# Altium project PR2017-DC_LoadMotherBoard.PrjPcb
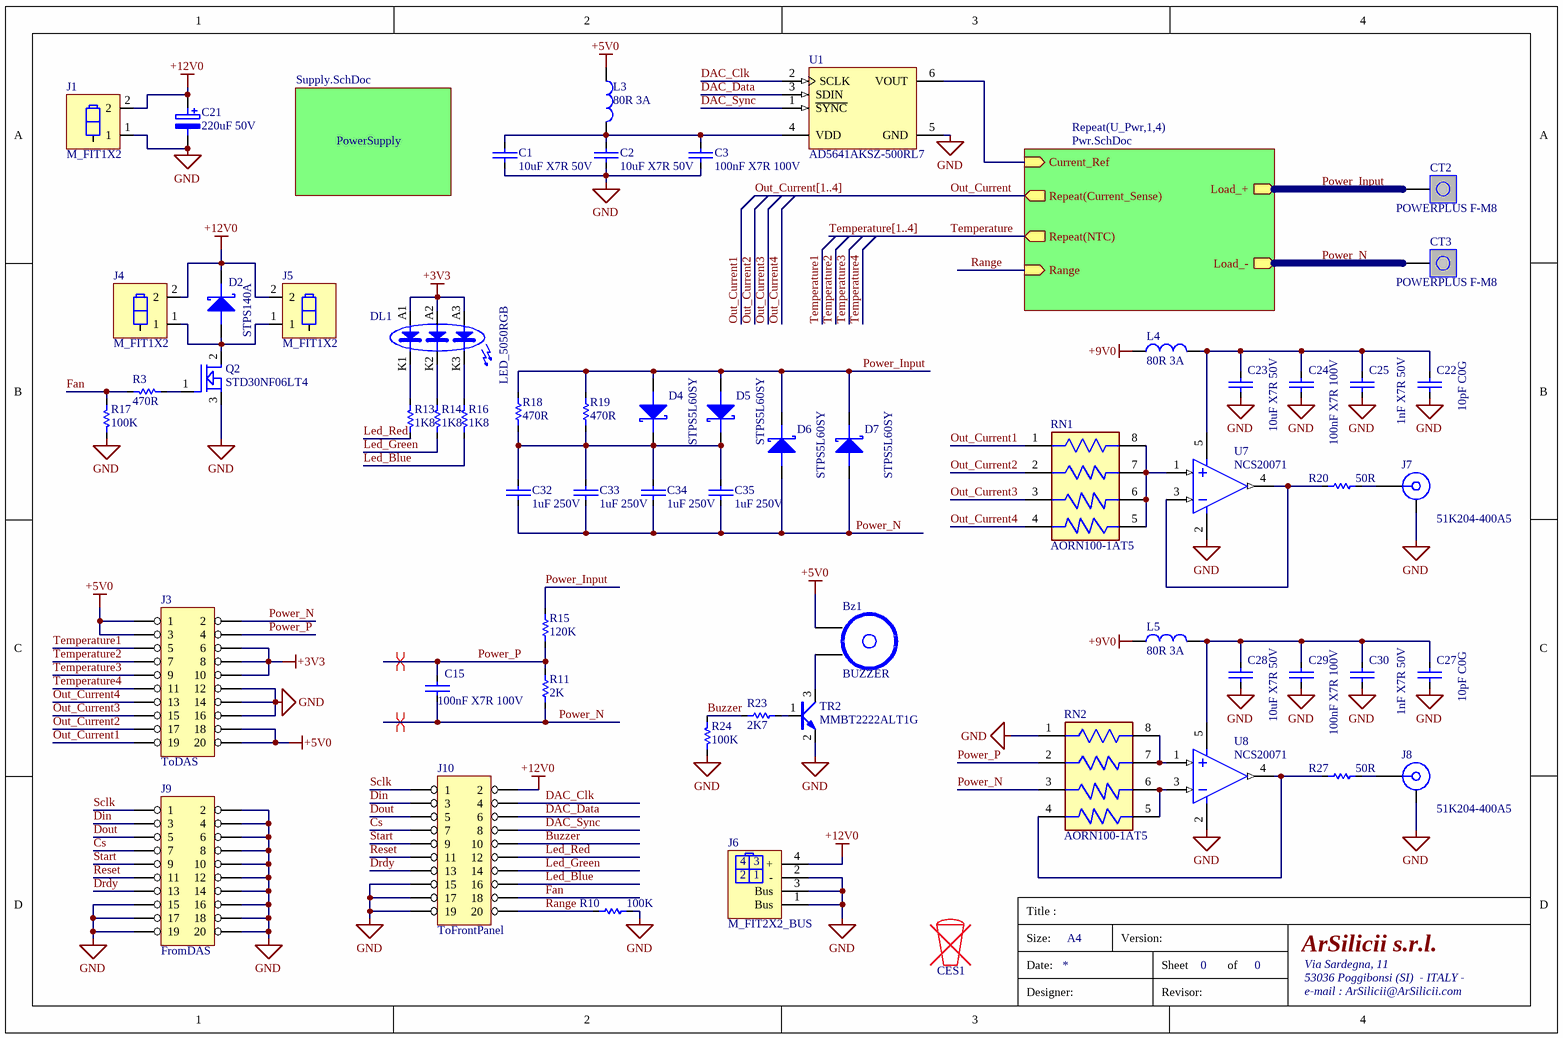
[diagram p0: PR2017-DC_LoadMotherBoard.SchDoc]
3 sheets, 193 parts. Net scope: hierarchical (ports join the sheet entries above them; power ports are global).
Board file: PR2017-DC_Load_Mosfet.PcbDoc
Sheets:
  PR2017-DC_LoadMotherBoard.SchDoc
    U_Pwr1 = Pwr.SchDoc
    U_Pwr2 = Pwr.SchDoc
    U_Pwr3 = Pwr.SchDoc
    U_Pwr4 = Pwr.SchDoc
    PowerSupply = Supply.SchDoc

## Sheet PR2017-DC_LoadMotherBoard.SchDoc
size A4; Organization: ArSilicii s.r.l.; Address1: Via Sardegna, 11; Address2: 53036 Poggibonsi (SI)  - ITALY -; Address3: e-mail : ArSilicii@ArSilicii.com; SheetNumber: 0; SheetTotal: 0

### Parts
Bz1  BUZZER  [CB13PA]
C1  10uF X7R 50V  [1206]
C2  10uF X7R 50V  [1206]
C3  100nF X7R 100V  [0805]
C15  100nF X7R 100V  [0805]
C21  220uF 50V  [C_G55]
C22  10pF C0G  [0805]
C23  10uF X7R 50V  [1206]
C24  100nF X7R 100V  [0805]
C25  1nF X7R 50V  [0603]
C27  10pF C0G  [0805]
C28  10uF X7R 50V  [1206]
C29  100nF X7R 100V  [0805]
C30  1nF X7R 50V  [0603]
C32  1uF 250V  [POL-P15]
C33  1uF 250V  [POL-P15]
C34  1uF 250V  [POL-P15]
C35  1uF 250V  [POL-P15]
CES1  CESTINO  [Cestino1]  (value not drawn)
CT2  POWERPLUS F-M8  [PowerPlus M8]
CT3  POWERPLUS F-M8  [PowerPlus M8]
D2  STPS140A  [SMA]
D4  STPS5L60SY  [SMC]
D5  STPS5L60SY  [SMC]
D6  STPS5L60SY  [SMC]
D7  STPS5L60SY  [SMC]
DL1  LED_5050RGB  [LED_5050RGB]
J1  M_FIT1X2  [M_FIT_JR1X2V]
J3  ToDAS  [IDC-20]
J4  M_FIT1X2  [M_FIT_JR1X2V]
J5  M_FIT1X2  [M_FIT_JR1X2V]
J6  M_FIT2X2_BUS  [M_FIT_JR2X2V]
J7  51K204-400A5  [ROS-51K204-400A5_V]
J8  51K204-400A5  [ROS-51K204-400A5_V]
J9  FromDAS  [IDC-20]
J10  ToFrontPanel  [IDC-20]
L3  80R 3A  [1206]
L4  80R 3A  [1206]
L5  80R 3A  [1206]
Q2  STD30NF06LT4  [DPAK]
R3  470R  [0805]
R10  100K  [0805]
R11  2K  [2512]
R13  1K8  [0805]
R14  1K8  [0805]
R15  120K  [2512]
R16  1K8  [0805]
R17  100K  [0805]
R18  470R  [0805]
R19  470R  [0805]
R20  50R  [0805]
R23  2K7  [0805]
R24  100K  [0805]
R27  50R  [0805]
RN1  AORN100-1AT5  [FP-AORN100-1AT5-IPC_C]
RN2  AORN100-1AT5  [FP-AORN100-1AT5-IPC_C]
TR2  MMBT2222ALT1G  [SOT-23]
U1  AD5641AKSZ-500RL7  [KS-6_L]
U7  NCS20071  [SOT-553-5]
U8  NCS20071  [SOT-553-5]

### Sub-sheets
PowerSupply = Supply.SchDoc: no entries
Repeat(U_Pwr,1,4) = Pwr.SchDoc: Current_Ref (in), Load_+ (out), Load_- (out), Repeat(Current_Sense) (out), Repeat(NTC) (out), Range (in)

### Nets
+3V3: DL1.A1 DL1.A2 DL1.A3 J3.6 J3.8 J3.10
+5V0: Bz1.1 J3.1 J3.3 J3.18 J3.20 L3.1
+9V0: L4.1 L5.1
+12V0: C21.1 D2.K J1.2 J4.2 J5.2 J6.4(+) J10.2
GND: C1.2 C2.2 C3.2 C21.2 C22.2 C23.2 C24.2 C25.2 C27.2 C28.2 C29.2 C30.2 J1.1 J3.12 J3.14 J3.16 J6.1(Bus) J6.2(-) J6.3(Bus) J7.MH J8.MH J9.2 J9.4 J9.6 J9.8 J9.10 J9.12 J9.14 J9.15 J9.16 J9.17 J9.18 J9.19 J9.20 J10.15 J10.17 J10.19 Q2.3(SOURCE) R10.1 R17.1 R24.1 RN2.1 TR2.2(E) U1.5(GND) U7.2 U8.2
Buzzer: J10.10 R23.2 R24.2
Cs: J9.7 J10.7
DAC_Clk: J10.4 U1.2(SCLK)
DAC_Data: J10.6 U1.3(SDIN)
DAC_Sync: J10.8 U1.1(~{SYNC})
Din: J9.3 J10.3
Dout: J9.5 J10.5
Drdy: J9.13 J10.13
Fan: J10.18 R3.2 R17.2
Led_Blue: J10.16 R16.1
Led_Green: J10.14 R14.1
Led_Red: J10.12 R13.1
Out_Current: sheet Repeat(U_Pwr,1,4)/Repeat(Current_Sense)
Out_Current1: J3.19 RN1.1
Out_Current2: J3.17 RN1.2
Out_Current3: J3.15 RN1.3
Out_Current4: J3.13 RN1.4
Power_Input: CT2.1 D4.A D5.A D6.K D7.K R15.1 R18.1 R19.1 ; sheet Repeat(U_Pwr,1,4)/Load_+
Power_N: C15.2 C32.2 C33.2 C34.2 C35.2 CT3.1 D6.A D7.A J3.2 R11.2 RN2.3 ; sheet Repeat(U_Pwr,1,4)/Load_-
Power_P: C15.1 J3.4 R11.1 R15.2 RN2.2
Range: J10.20 R10.2 ; sheet Repeat(U_Pwr,1,4)/Range
Reset: J9.11 J10.11
Sclk: J9.1 J10.1
Start: J9.9 J10.9
Temperature: sheet Repeat(U_Pwr,1,4)/Repeat(NTC)
Temperature1: J3.5
Temperature2: J3.7
Temperature3: J3.9
Temperature4: J3.11
NetBz1_2: Bz1.2 TR2.3(C)
NetC1_1: C1.1 C2.1 C3.1 L3.2 U1.4(VDD)
NetC22_1: C22.1 C23.1 C24.1 C25.1 L4.2 U7.5
NetC27_1: C27.1 C28.1 C29.1 C30.1 L5.2 U8.5
NetC32_1: C32.1 C33.1 C34.1 C35.1 D4.K D5.K R18.2 R19.2
NetD2_A: D2.A J4.1 J5.1 Q2.2(DRAIN)
NetDL1_K1: DL1.K1 R13.2
NetDL1_K2: DL1.K2 R14.2
NetDL1_K3: DL1.K3 R16.2
NetJ7_1: J7.1 R20.1
NetJ8_1: J8.1 R27.1
NetQ2_1: Q2.1(GATE) R3.1
NetR20_2: R20.2 U7.3 U7.4
NetR21_U_Pwr1_1: U1.6(VOUT) ; sheet Repeat(U_Pwr,1,4)/Current_Ref
NetR23_1: R23.1 TR2.1(B)
NetR27_2: R27.2 RN2.4 U8.4
NetRN1_5: RN1.5 RN1.6 RN1.7 RN1.8 U7.1
NetRN2_5: RN2.5 RN2.6 U8.3
NetRN2_7: RN2.7 RN2.8 U8.1

### Buses and harness runs
bus Out_Current[1..4]
bus Temperature[1..4]

### Layout directives
differential pair: Power_N, Power_P

### Notes on the sheet
- Title :
- Size:
- Date:
- A4
- Version:
- Sheet
- of
- Designer:
- Revisor:

### Library data of the parts
Bz1 = BUZZER: SMD/TH: TH; 1 Supplier: *; 1 Supplier Part Number: *; 1 Supplier Unit Price: *; 2 Supplier: *; 2 Supplier Part Number: *; 2 Supplier Unit Price: *; 3 Supplier: *; 3 Supplier Part Number: *; 3 Supplier Unit Price: *; ArSilicii Part Number: *; Manufacturer: *; Manufacturer Part Number: *; ComponentLink1URL: *; ComponentLink2URL: *; ComponentLink1Description: *; ComponentLink2Description: *; HelpURL: *
C1 C2 C23 C28 = CAP_10uF X7R 50V_1206: Capacità; ArSilicii Part Number: CPC0232011; Manufacturer Part Number: CL31B106KBHNNNE; SMD/TH: SMD; 1 Supplier: ARROW ELECTRONICS ITALIA S.R.L.; 1 Supplier Part Number: CL31B106KBHNNNE; 1 Supplier Unit Price: *; 2 Supplier: *; 2 Supplier Part Number: *; 2 Supplier Unit Price: *; 3 Supplier: *; 3 Supplier Part Number: *; 3 Supplier Unit Price: *; Manufacturer: *; ComponentLink1URL: *; ComponentLink2URL: *; ComponentLink1Description: Datasheet for 10uF X7R 25V; ComponentLink2Description: *; HelpURL: *
C3 C15 C24 C29 = CAP_100nF X7R 100V_0805: Capacità; ArSilicii Part Number: CPC0213101; Manufacturer: SAMSUNG; Manufacturer Part Number: CL21B104KCFSFNG; SMD/TH: SMD; 1 Supplier: ARROW ELECTRONICS ITALIA S.R.L.; 1 Supplier Part Number: CL21B104KCFSFNG; 1 Supplier Unit Price: *; 2 Supplier: FARNELL ITALIA S.R.L.; 2 Supplier Part Number: 1907331; 2 Supplier Unit Price: *; 3 Supplier: *; 3 Supplier Part Number: *; 3 Supplier Unit Price: *; ComponentLink1URL: *; ComponentLink2URL: *; ComponentLink1Description: *; ComponentLink2Description: *; HelpURL: *
C21 = CAP_EL_220uF 50V: Capacità polarizzata; ArSilicii Part Number: CPC0402221; Manufacturer: Nichicon; Manufacturer Part Number: UPS1H221MPD; SMD/TH: TH; 1 Supplier: ARROW ELECTRONICS ITALIA S.R.L.; 1 Supplier Part Number: *; 1 Supplier Unit Price: 0,04516; 2 Supplier: RS COMPONENTS S.P.A.; 2 Supplier Part Number: 5194346; 2 Supplier Unit Price: *; 3 Supplier: *; 3 Supplier Part Number: *; 3 Supplier Unit Price: *; ComponentLink1URL: http://docs-europe.electrocomponents.com/webdocs/0649/0900766b8064973a.pdf; ComponentLink2URL: *; ComponentLink1Description: Datasheet for 220uF 50V; ComponentLink2Description: *; HelpURL: *
C22 C27 = CAP_10pF C0G_0805: Capacità; ArSilicii Part Number: CPC0614010; SMD/TH: SMD; 1 Supplier: *; 1 Supplier Part Number: *; 1 Supplier Unit Price: 0,09; 2 Supplier: *; 2 Supplier Part Number: *; 2 Supplier Unit Price: *; 3 Supplier: *; 3 Supplier Part Number: *; 3 Supplier Unit Price: *; Manufacturer: *; Manufacturer Part Number: *; ComponentLink1URL: *; ComponentLink2URL: *; ComponentLink1Description: *; ComponentLink2Description: *; HelpURL: *
C25 C30 = CAP_1nF X7R 50V_0603: Capacità; ArSilicii Part Number: CPC0263001; Manufacturer: KEMET; Manufacturer Part Number: C0603C102K5RACTU; SMD/TH: SMD; 1 Supplier: ARROW ELECTRONICS ITALIA S.R.L.; 1 Supplier Part Number: CC0603JRX7R9BB102; 1 Supplier Unit Price: *; 2 Supplier: *; 2 Supplier Part Number: *; 2 Supplier Unit Price: *; 3 Supplier: *; 3 Supplier Part Number: *; 3 Supplier Unit Price: *; ComponentLink1URL: *; ComponentLink2URL: *; ComponentLink1Description: *; ComponentLink2Description: *; HelpURL: *
C32-C35 = CAP_POL_1uF 250V P.15: Capacità poliestere; ArSilicii Part Number: CPC0502002; Manufacturer Part Number: MKTR60II4100ZB30K; SMD/TH: TH; 1 Supplier: *; 1 Supplier Part Number: *; 1 Supplier Unit Price: *; 2 Supplier: *; 2 Supplier Part Number: *; 2 Supplier Unit Price: *; 3 Supplier: *; 3 Supplier Part Number: *; 3 Supplier Unit Price: *; Manufacturer: *; ComponentLink1URL: *; ComponentLink2URL: *; ComponentLink1Description: *; ComponentLink2Description: *; HelpURL: *
CT2 CT3 = PAD_POWERPLUS F-M8: Singolo contatto; ArSilicii Part Number: QC04000180; Manufacturer: WURTH; Manufacturer Part Number: 93517; SMD/TH: TH; 1 Supplier: Würth Elektronik ICS GmbH & Co. KG; 1 Supplier Part Number: S98978; 1 Supplier Unit Price: *; 2 Supplier: *; 2 Supplier Part Number: *; 2 Supplier Unit Price: *; 3 Supplier: *; 3 Supplier Part Number: *; 3 Supplier Unit Price: *; ComponentLink1URL: *; ComponentLink2URL: *; ComponentLink1Description: *; ComponentLink2Description: *; HelpURL: *
D2 = DIODE SCHOTTKY_STPS140A: Diodo Schottky; Manufacturer: STMicroelectronics; ArSilicii Part Number: CPDS117000; SMD/TH: SMD; Manufacturer Part Number: STPS140A; 1 Supplier Part Number: STMSTPS140A; 2 Supplier: *; 2 Supplier Part Number: *; 2 Supplier Unit Price: *; 3 Supplier Part Number: *; 1 Supplier: ARROW ELECTRONICS ITALIA S.R.L.; 1 Supplier Unit Price: 0,0600; 3 Supplier: *; 3 Supplier Unit Price: *; ComponentLink1URL: http://www.st.com/web/en/resource/technical/document/datasheet/CD00001107.pdf; ComponentLink2URL: *; ComponentLink1Description: Datasheet for STPS140A; ComponentLink2Description: *; HelpURL: *
D4-D7 = DIODE SCHOTTKY_STPS5L60SY: Automotive power Schottky rectifier; Manufacturer: STM; SMD/TH: SMD; Manufacturer Part Number: STPS5L60SY; 1 Supplier Part Number: 511-STPS5L60SY; 2 Supplier: *; 2 Supplier Part Number: *; 2 Supplier Unit Price: *; 3 Supplier Part Number: *; 1 Supplier: MOUSER; 1 Supplier Unit Price: 0,678; 3 Supplier: *; 3 Supplier Unit Price: *; ArSilicii Part Number: *; ComponentLink2URL: *; ComponentLink2Description: *; HelpURL: *
DL1 = LED_5050RGB: LED RGB; SMD/TH: SMD; 1 Supplier: *; 1 Supplier Part Number: *; 1 Supplier Unit Price: *; 2 Supplier: *; 2 Supplier Part Number: *; 2 Supplier Unit Price: *; 3 Supplier: *; 3 Supplier Part Number: *; 3 Supplier Unit Price: *; ArSilicii Part Number: *; Manufacturer: *; Manufacturer Part Number: *; ComponentLink1URL: *; ComponentLink2URL: *; ComponentLink1Description: *; ComponentLink2Description: *; HelpURL: *
J1 J4 J5 = M_FIT1X2: Mini Fit Junior 2 poli; ArSilicii Part Number: QA02006000; Manufacturer: Molex; SMD/TH: TH; 1 Supplier: ABACUS ECC S.R.L. - UNIPERSONALE; 1 Supplier Part Number: *; 1 Supplier Unit Price: 0,07900; 2 Supplier: HT COMPONENTI ELETTRONICI S.R.L.; 2 Supplier Part Number: *; 2 Supplier Unit Price: *; 3 Supplier: *; 3 Supplier Part Number: *; 3 Supplier Unit Price: *; Manufacturer Part Number: 39-28-1023; ComponentLink1URL: http://www.molex.com/webdocs/datasheets/pdf/en-us/0039281023_PCB_HEADERS.pdf; ComponentLink2URL: *; ComponentLink1Description: Datasheet for M_FIT1X2; ComponentLink2Description: *; HelpURL: *
J3 J9 = HEADER 10X2: System: Connector; SMD/TH: TH; 1 Supplier: *; 1 Supplier Part Number: *; 1 Supplier Unit Price: *; 2 Supplier: *; 2 Supplier Part Number: *; 2 Supplier Unit Price: *; 3 Supplier: *; 3 Supplier Part Number: *; 3 Supplier Unit Price: *; ArSilicii Part Number: *; Manufacturer: *; Manufacturer Part Number: *; ComponentLink2URL: *; ComponentLink2Description: *
  J3: Parameter 1: *; Parameter 2: *; ComponentLink4Description: *; ComponentLink4URL: *
  J9: ComponentLink1URL: *; ComponentLink1Description: *
J6 = M_FIT2X2_BUS: Mini Fit Junior 4 poli; ArSilicii Part Number: QA02009000; Manufacturer: Molex; SMD/TH: TH; 1 Supplier: ABACUS ECC S.R.L. - UNIPERSONALE; 1 Supplier Part Number: *; 1 Supplier Unit Price: 0,08856; 2 Supplier: SIRIO S.R.L.; 2 Supplier Part Number: P6657I-04; 2 Supplier Unit Price: *; 3 Supplier: ELECTRONIC CENTER S.P.A.; 3 Supplier Part Number: EY5900-W04ST; 3 Supplier Unit Price: *; Manufacturer Part Number: 39-28-1043; ComponentLink1URL: http://www.molex.com/webdocs/datasheets/pdf/en-us/0039281043_PCB_HEADERS.pdf; ComponentLink2URL: *; ComponentLink1Description: Datasheet for M_FIT2X2; ComponentLink2Description: *; HelpURL: *
J7 J8 = CMP-0753-00004-1: BNC 50R Right Angle Jack, Panel Feedthrough, Up to 10 GHz, -55 to 155 degC; Manufacturer: Rosenberger; Design Note: Footprint in library is a generic example - only application specific footprint delivers High Performance; PartNumber: 51K204-400A5; PackageReference: 51K204-400A5; DatasheetVersion: d00; ComponentLink2Description: Datasheet; ComponentLink5Description: Webshop / RFQ; ComponentLink1URL: http://www.rosenberger.de; ComponentLink4URL: http://rosenberger.de/ok/images/documents/spez/51.pdf; PackageVersion: d00; ComponentLink5URL: http://www.rosenberger.com/en/contact/sales/; ComponentLink3URL: http://rosenberger.de/ok/images/documents/db/51K204-400A5.pdf; ComponentLink2URL: http://rosenberger.de/ok/images/documents/db/51K204-400A5.pdf; ComponentLink1Description: Manufacturer URL; Mounting Technology: Through Hole; PackageDescription: 50R BNC Right Angle Jack, 12.5 x 32.6 x 14.5 mm; ComponentLink4Description: Series Overview / Design Note; ComponentLink3Description: Package Specification
J10 = HEADER 10X2: SMD/TH: TH; 1 Supplier: *; 1 Supplier Part Number: *; 1 Supplier Unit Price: *; 2 Supplier: *; 2 Supplier Part Number: *; 2 Supplier Unit Price: *; 3 Supplier: *; 3 Supplier Part Number: *; 3 Supplier Unit Price: *; ArSilicii Part Number: *; Manufacturer: *; Manufacturer Part Number: *; ComponentLink2URL: *; ComponentLink2Description: *; Parameter 1: *; Parameter 2: *; ComponentLink4Description: *; ComponentLink4URL: *
L3-L5 = Ferrite 80R 3A: Ferrite; ArSilicii Part Number: CPF0006000; Manufacturer: Wurth Elektronik; Manufacturer Part Number: 74279215; SMD/TH: SMD; 1 Supplier: RS COMPONENTS S.P.A.; 1 Supplier Part Number: 3275550P; 1 Supplier Unit Price: 0,21000; 2 Supplier: *; 2 Supplier Part Number: *; 2 Supplier Unit Price: *; 3 Supplier: *; 3 Supplier Part Number: *; 3 Supplier Unit Price: *; ComponentLink1URL: http://docs-europe.electrocomponents.com/webdocs/0033/0900766b80033a26.pdf; ComponentLink2URL: *; ComponentLink1Description: Datasheet for Ferrite 80R 3A; ComponentLink2Description: *; HelpURL: *; Supplier 1: Digi-Key; Supplier Part Number 1: 732-1629-1-ND
Q2 = MOS-N STD30NF06: N-CHANNEL 60V - 0.020 Ω - 28A IPAK/DPAK  STripFET™ II POWER MOSFET; ArSilicii Part Number: CPTP200030; Manufacturer: STMicroelectronics; SMD/TH: SMD; 1 Supplier: EBV ELEKTRONIK S.R.L.; 1 Supplier Part Number: STD30NF06LT4/STM; 1 Supplier Unit Price: 0,203; 2 Supplier: *; 2 Supplier Part Number: *; 2 Supplier Unit Price: *; 3 Supplier: *; 3 Supplier Part Number: *; 3 Supplier Unit Price: *; Manufacturer Part Number: STD30NF06LT4; ComponentLink1URL: http://www.mouser.com/ds/2/389/CD00002155-250311.pdf; ComponentLink2URL: *; ComponentLink1Description: Datasheet for STD30NF06LT4; ComponentLink2Description: *; HelpURL: *; Supplier 1: Digi-Key; Supplier Part Number 1: 497-4101-1-ND
R3 R10 R11 R13-R20 R23 R24 R27 = RES_SMD: Resistenza; SMD/TH: SMD; 1 Supplier: *; 1 Supplier Part Number: *; 1 Supplier Unit Price: *; 2 Supplier: *; 2 Supplier Part Number: *; 2 Supplier Unit Price: *; 3 Supplier: *; 3 Supplier Part Number: *; 3 Supplier Unit Price: *; ArSilicii Part Number: *; Manufacturer: *; Manufacturer Part Number: *; ComponentLink1URL: *; ComponentLink2URL: *; ComponentLink1Description: *; ComponentLink2Description: *; HelpURL: *
RN1 RN2 = CMP-02406-000003-1: RES NETWORK 4 RES MULT OHM 8SOIC; Manufacturer: Vishay; Resistance: 1/100kΩ; Standoff Height: 0.1524mm; Temperature Coefficient: 25ppm/°C; Automotive Grade: Grade 0; Tolerance: 0.1%; Number Of Resistors: 4; Value: 1/100kΩ; Power Per Resistor: 100mW; Power Rating: 400mW; Lead Free: Yes; Package: AORN100-1AT5; Manufacturer Part Number: AORN100-1AT5; Category: Res; Temperature Range High: +155°C; Device Class L3: Resistor Arrays; Automotive: Yes; Temperature: -55°C to +155°C; Termination: Gull-Wing; Ipc Land Pattern Name: SOIC127P607X173-8; Device Class L1: Passive Components; Series: AORN; Octopart: https://octopart.com/aorn1001at5-vishay-54384707; ComponentLink2Description: Datasheet; Digikey Description: RES NETWORK 4 RES MULT OHM 8SOIC; Composition: Thin Film; Device Class L2: Resistors; ComponentLink2URL: https://www.vishay.com/docs/60127/aorn.pdf; RoHS: TRUE; Temperature Range Low: -55°C; Height: 1.73mm
TR2 = NPN_MMBT2222ALT1G: NPN Transistor; ArSilicii Part Number: CPTS001000; Manufacturer: ON SEMICONDUCTOR; SMD/TH: SMD; Supplier 1: Farnell; Supplier Part Number 1: 1459098; 1 Supplier: ARROW ELECTRONICS ITALIA S.R.L.; 1 Supplier Part Number: SCGMMBT2222ALT1G; 1 Supplier Unit Price: 0,00777; 2 Supplier: Farnell; 2 Supplier Part Number: 1459098; 2 Supplier Unit Price: 0,085; 3 Supplier: *; 3 Supplier Part Number: *; 3 Supplier Unit Price: *; Manufacturer Part Number: MMBT2222ALT1G; ComponentLink1URL: http://www.onsemi.com/pub_link/Collateral/MMBT2222LT1-D.PDF; ComponentLink2URL: *; ComponentLink1Description: Datasheet for MMBT2222ALT1G; ComponentLink2Description: *; HelpURL: D:\Documenti ArSilicii\DataSheet\Transistor\MMBT2222LT1-D.pdf
U1 = CMP-0318-01433-2: Single 14-Bit nanoDAC with SPI Interface, 5 V, <100 uA, -40 to +125 degC, KS-6, Pb-Free, Reel; Generic Part Number: AD5641; Manufacturer: Analog Devices; Resolution (Bits): 14; Max V+: 5.5V; Settling Time: 6Âµs; # DAC Outputs: 1; Single Supply: Yes; Op Pwr Diss: 550ÂµW; ComponentLink1URL: http://www.analog.com/en/index.html; ComponentLink3Description: Package Specification; ComponentLink4URL: http://www.analog.com/en/digital-to-analog-converters/da-converters/ad5641/products/product.html; RevisionNote: Component URL fixed; PackageReference: KS-6; Packing: Reel; ComponentLink3URL: http://www.analog.com/static/imported-files/packages/PKG_PDF/SC70(KS)/KS_6.pdf; PackageVersion: 072809-A; RoHS: Y; ComponentLink2Description: Datasheet; PartNumber: AD5641AKSZ-500RL7; Mounting Technology: Surface Mount; ComponentLink2URL: http://www.analog.com/static/imported-files/data_sheets/AD5641.pdf; ComponentLink4Description: Product URL; PackageDescription: 6-Lead Thin Shrink Small Outline Transistor Package [SC70]; ComponentLink1Description: Manufacturer URL; DatasheetVersion: Rev.D; Code_JEDEC: MO-203-AB
U7 U8 = NCS20071: Rail-to-Rail Input/Output, 3 MHz Op Amps; Manufacturer: Microchip Technology; Manufacturer Part Number: MCP6021-E/SN; SMD/TH: SMD; 1 Supplier: DigiKey; 1 Supplier Part Number: MCP6021-E/SN-ND; 1 Supplier Unit Price: 1,22; 2 Supplier: *; 2 Supplier Part Number: *; 2 Supplier Unit Price: *; 3 Supplier: *; 3 Supplier Part Number: *; 3 Supplier Unit Price: *; ArSilicii Part Number: *; ComponentLink1URL: http://ww1.microchip.com/downloads/en/DeviceDoc/21685d.pdf; ComponentLink2URL: *; ComponentLink1Description: Datasheet for MCP6021; ComponentLink2Description: *; HelpURL: *
CES1 = CESTINO: 1 Supplier: *; 1 Supplier Part Number: *; 1 Supplier Unit Price: *; 2 Supplier: *; 2 Supplier Part Number: *; 2 Supplier Unit Price: *; 3 Supplier: *; 3 Supplier Part Number: *; 3 Supplier Unit Price: *; ArSilicii Part Number: *; Manufacturer: *; Manufacturer Part Number: *; ComponentLink1URL: *; ComponentLink2URL: *; ComponentLink1Description: *; ComponentLink2Description: *; HelpURL: *; SMD/TH: *

## Sheet Pwr.SchDoc
size A4; Organization: ArSilicii s.r.l.; Address1: Via Sardegna, 11; Address2: 53036 Poggibonsi (SI)  - ITALY -; Address3: e-mail : ArSilicii@ArSilicii.com; SheetNumber: 0; SheetTotal: 0
Used 4 times, as channels U_Pwr1, U_Pwr2, U_Pwr3, U_Pwr4. Parts and nets are listed once, with the designators drawn on the sheet.
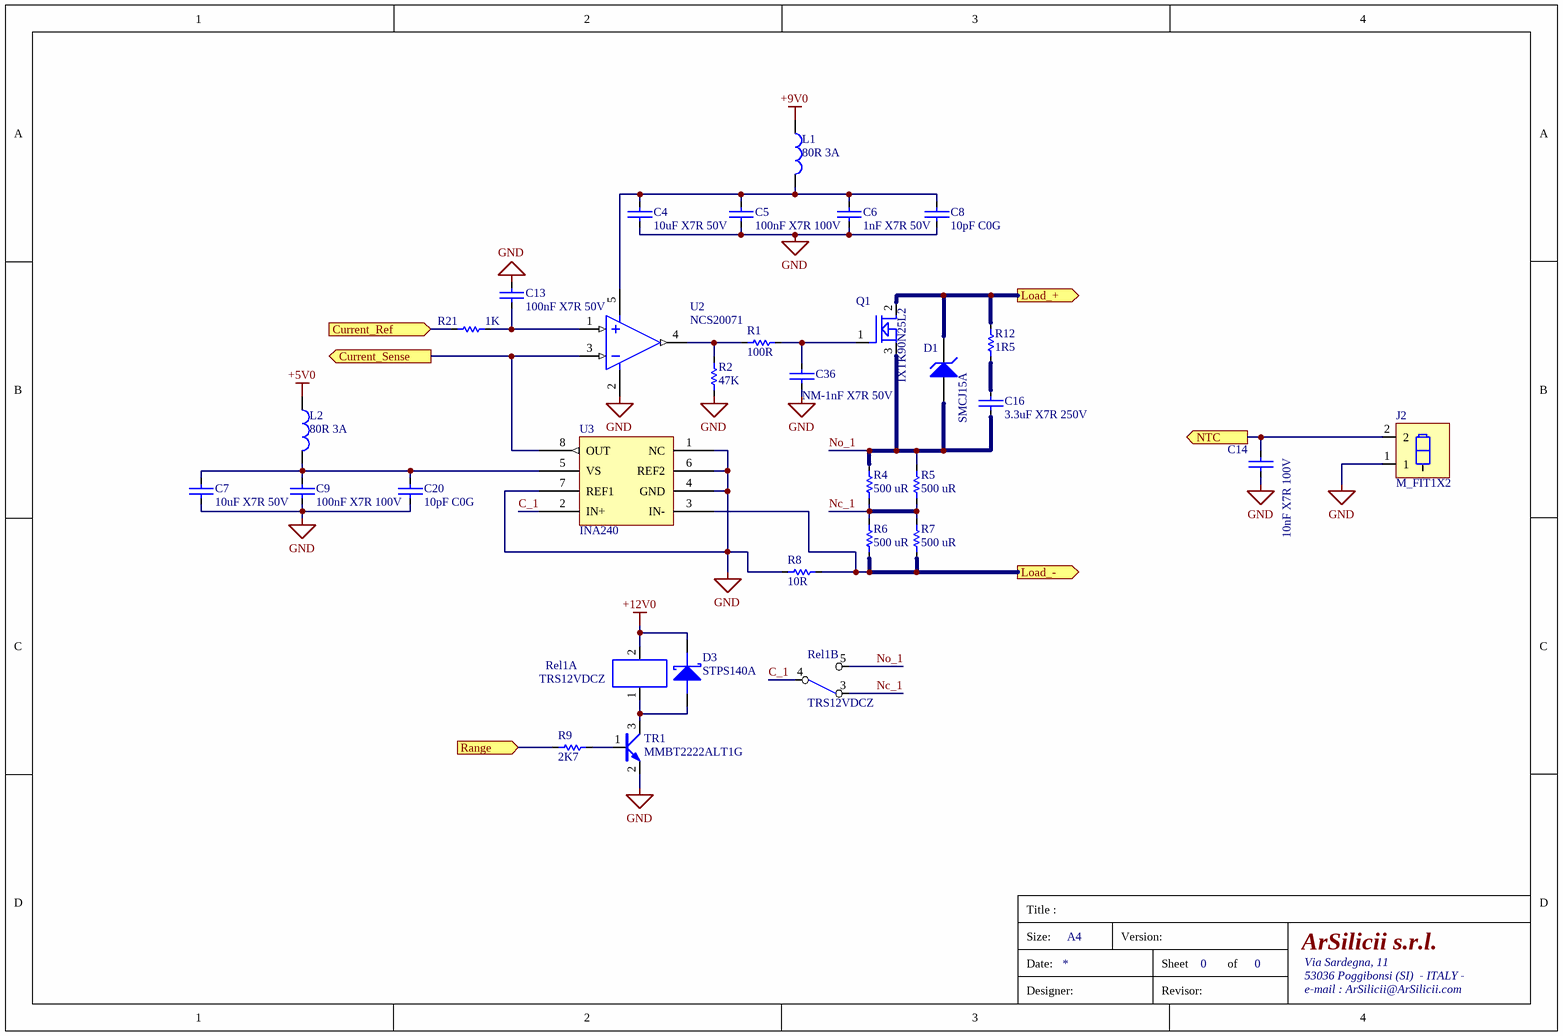
[diagram p1: Pwr.SchDoc]

### Parts
C4  10uF X7R 50V  [1206]
C5  100nF X7R 100V  [0805]
C6  1nF X7R 50V  [0603]
C7  10uF X7R 50V  [1206]
C8  10pF C0G  [0805]
C9  100nF X7R 100V  [0805]
C13  100nF X7R 50V  [0603]
C14  10nF X7R 100V  [0805]
C16  3.3uF X7R 250V  [2220]
C20  10pF C0G  [0805]
C36  NM-1nF X7R 50V  [0603]
D1  SMCJ15A  [LFUS-DO-214AB-2_V]
D3  STPS140A  [SMA]
J2  M_FIT1X2  [M_FIT_JR1X2V]
L1  80R 3A  [1206]
L2  80R 3A  [1206]
Q1  IXTK90N25L2  [PLUS-247]
R1  100R  [0805]
R2  47K  [0805]
R4  500 uR  [2512]
R5  500 uR  [2512]
R6  500 uR  [2512]
R7  500 uR  [2512]
R8  10R  [1206]
R9  2K7  [0805]
R12  1R5  [2512]
R21  1K  [0805]
Rel1  TRS12VDCZ  [RELE_TRS]  (parts A,B of 2)
TR1  MMBT2222ALT1G  [SOT-23]
U2  NCS20071  [SOT-553-5]
U3  INA240  [TSSOP-8]

### Ports
Current_Ref (in), Current_Sense (out), Load_+ (out), Load_- (out), NTC (out), Range (in)

### Nets
+5V0: L2.1
+9V0: L1.1
+12V0: D3.K Rel1.2
GND: C4.2 C5.2 C6.2 C7.2 C8.2 C9.2 C13.2 C14.2 C20.2 C36.1 J2.1 R2.2 R8.2 TR1.2(E) U2.2 U3.1(NC) U3.4(GND) U3.6(REF2) U3.7(REF1)
C_1: Rel1.4 U3.2(IN+)
Current_Ref: R21.1 ; port Current_Ref
Current_Sense: U2.3 U3.8(OUT) ; port Current_Sense
Load_+: D1.2(K) Q1.2(DRAIN) R12.1 ; port Load_+
Load_-: R6.2 R7.2 R8.1 U3.3(IN-) ; port Load_-
Nc_1: R4.2 R5.2 R6.1 R7.1 Rel1.3
No_1: C16.2 D1.1(A) Q1.3(SOURCE) R4.1 R5.1 Rel1.5
NTC: C14.1 J2.2 ; port NTC
Range: R9.2 ; port Range
NetC4_1: C4.1 C5.1 C6.1 C8.1 L1.2 U2.5
NetC7_1: C7.1 C9.1 C20.1 L2.2 U3.5(VS)
NetC13_1: C13.1 R21.2 U2.1
NetC16_1: C16.1 R12.2
NetC36_2: C36.2 Q1.1(GATE) R1.2
NetD3_A: D3.A Rel1.1 TR1.3(C)
NetR1_1: R1.1 R2.1 U2.4
NetR9_1: R9.1 TR1.1(B)

### Channels
U_Pwr1: designators end in _U_Pwr1; ports Current_Ref=NetR21_U_Pwr1_1 Current_Sense=Out_Current1 Load_+=Power_Input Load_-=Power_N NTC=Temperature1 Range=Range
U_Pwr2: designators end in _U_Pwr2; ports Current_Ref=NetR21_U_Pwr1_1 Current_Sense=Out_Current2 Load_+=Power_Input Load_-=Power_N NTC=Temperature2 Range=Range
U_Pwr3: designators end in _U_Pwr3; ports Current_Ref=NetR21_U_Pwr1_1 Current_Sense=Out_Current3 Load_+=Power_Input Load_-=Power_N NTC=Temperature3 Range=Range
U_Pwr4: designators end in _U_Pwr4; ports Current_Ref=NetR21_U_Pwr1_1 Current_Sense=Out_Current4 Load_+=Power_Input Load_-=Power_N NTC=Temperature4 Range=Range

### Notes on the sheet
- Title :
- Size:
- Date:
- A4
- Version:
- Sheet
- of
- Designer:
- Revisor:

### Library data of the parts
C4 C7 = CAP_10uF X7R 50V_1206: as C1 on sheet PR2017-DC_LoadMotherBoard; 1 Supplier: ARROW ELECTRONICS ITALIA S.R.L.; 1 Supplier Part Number: CL31B106KBHNNNE; 1 Supplier Unit Price: *; 2 Supplier: *; 2 Supplier Part Number: *; 2 Supplier Unit Price: *; 3 Supplier: *; 3 Supplier Part Number: *; 3 Supplier Unit Price: *; Manufacturer: *; ComponentLink1URL: *; ComponentLink2URL: *; ComponentLink1Description: Datasheet for 10uF X7R 25V; ComponentLink2Description: *; HelpURL: *
C5 C9 C14 = CAP_100nF X7R 100V_0805: as C3 on sheet PR2017-DC_LoadMotherBoard; 1 Supplier: ARROW ELECTRONICS ITALIA S.R.L.; 1 Supplier Part Number: CL21B104KCFSFNG; 1 Supplier Unit Price: *; 2 Supplier: FARNELL ITALIA S.R.L.; 2 Supplier Part Number: 1907331; 2 Supplier Unit Price: *; 3 Supplier: *; 3 Supplier Part Number: *; 3 Supplier Unit Price: *; ComponentLink1URL: *; ComponentLink2URL: *; ComponentLink1Description: *; ComponentLink2Description: *; HelpURL: *
C6 C13 C36 = CAP_1nF X7R 50V_0603: as C25 on sheet PR2017-DC_LoadMotherBoard; 1 Supplier: ARROW ELECTRONICS ITALIA S.R.L.; 1 Supplier Part Number: CC0603JRX7R9BB102; 1 Supplier Unit Price: *; 2 Supplier: *; 2 Supplier Part Number: *; 2 Supplier Unit Price: *; 3 Supplier: *; 3 Supplier Part Number: *; 3 Supplier Unit Price: *; ComponentLink1URL: *; ComponentLink2URL: *; ComponentLink1Description: *; ComponentLink2Description: *; HelpURL: *
C8 C20 = CAP_10pF C0G_0805: as C22 on sheet PR2017-DC_LoadMotherBoard; 1 Supplier: *; 1 Supplier Part Number: *; 1 Supplier Unit Price: 0,09; 2 Supplier: *; 2 Supplier Part Number: *; 2 Supplier Unit Price: *; 3 Supplier: *; 3 Supplier Part Number: *; 3 Supplier Unit Price: *; Manufacturer: *; Manufacturer Part Number: *; ComponentLink1URL: *; ComponentLink2URL: *; ComponentLink1Description: *; ComponentLink2Description: *; HelpURL: *
C16 = CAP_1uF X7R 250V_2220: Capacità; Manufacturer: TDK; Manufacturer Part Number: CGA9N3X7R2E105K230KA; SMD/TH: SMD; 1 Supplier: FARNELL ITALIA S.R.L.; 1 Supplier Part Number: 2435506; 1 Supplier Unit Price: 0,606; 2 Supplier: MOUSER; 2 Supplier Part Number: 810-CGA9N3X7R2E105K; 2 Supplier Unit Price: 0,594; 3 Supplier: *; 3 Supplier Part Number: *; 3 Supplier Unit Price: *; ArSilicii Part Number: *; ComponentLink1URL: *; ComponentLink2URL: *; ComponentLink1Description: *; ComponentLink2Description: *; HelpURL: *
D1 = CMP-2000-07102-1: Transient Voltage Suppression Diode, 15 V, -65 to 150 degC, 2-Pin DO-214AB (SMCJ), RoHS, Tape and Reel; Manufacturer: Littelfuse; Directional: Uni-Directional; Power Dissipation: 1500W; Clamping Voltage-Max: 24.4V; Breakdown Voltage-Min: 16.7V; Breakdown Voltage-Max: 18.5V; Mounting Technology: SurfaceMount; Package Reference: DO-214AB; Manufacturer URL: http://www.littelfuse.com/; Package Description: 2-Pin Surface Mount Device, Body 6.855 x 5.905 mm; Datasheet URL: http://www.littelfuse.com/products/tvs-diodes/surface-mount/~/media/electronics/datasheets/tvs_diodes/littelfuse_tvs_diode_smcj_datasheet.pdf.pdf; Datasheet Version: 11/2015
D3 = DIODE SCHOTTKY_STPS140A: as D2 on sheet PR2017-DC_LoadMotherBoard; Manufacturer Part Number: STPS140A; 1 Supplier Part Number: STMSTPS140A; 2 Supplier: *; 2 Supplier Part Number: *; 2 Supplier Unit Price: *; 3 Supplier Part Number: *; 1 Supplier: ARROW ELECTRONICS ITALIA S.R.L.; 1 Supplier Unit Price: 0,0600; 3 Supplier: *; 3 Supplier Unit Price: *; ComponentLink1URL: http://www.st.com/web/en/resource/technical/document/datasheet/CD00001107.pdf; ComponentLink2URL: *; ComponentLink1Description: Datasheet for STPS140A; ComponentLink2Description: *; HelpURL: *
J2 = M_FIT1X2: as J1 on sheet PR2017-DC_LoadMotherBoard; 1 Supplier: ABACUS ECC S.R.L. - UNIPERSONALE; 1 Supplier Part Number: *; 1 Supplier Unit Price: 0,07900; 2 Supplier: HT COMPONENTI ELETTRONICI S.R.L.; 2 Supplier Part Number: *; 2 Supplier Unit Price: *; 3 Supplier: *; 3 Supplier Part Number: *; 3 Supplier Unit Price: *; Manufacturer Part Number: 39-28-1023; ComponentLink1URL: http://www.molex.com/webdocs/datasheets/pdf/en-us/0039281023_PCB_HEADERS.pdf; ComponentLink2URL: *; ComponentLink1Description: Datasheet for M_FIT1X2; ComponentLink2Description: *; HelpURL: *
L1 L2 = Ferrite 80R 3A: as L3 on sheet PR2017-DC_LoadMotherBoard; 1 Supplier: RS COMPONENTS S.P.A.; 1 Supplier Part Number: 3275550P; 1 Supplier Unit Price: 0,21000; 2 Supplier: *; 2 Supplier Part Number: *; 2 Supplier Unit Price: *; 3 Supplier: *; 3 Supplier Part Number: *; 3 Supplier Unit Price: *; ComponentLink1URL: http://docs-europe.electrocomponents.com/webdocs/0033/0900766b80033a26.pdf; ComponentLink2URL: *; ComponentLink1Description: Datasheet for Ferrite 80R 3A; ComponentLink2Description: *; HelpURL: *; Supplier 1: Digi-Key; Supplier Part Number 1: 732-1629-1-ND
Q1 = IXTK90N25L2: MOS CANALE N-250V-90A Linear; ArSilicii Part Number: CPTP200080; Manufacturer Part Number: IPB90N06S404ATMA2; SMD/TH: SMD; 1 Supplier: EBV ELEKTRONIK S.R.L.; 1 Supplier Part Number: PB90N06S4-04; 1 Supplier Unit Price: 0,56; 2 Supplier: RS COMPONENTS S.R.L.; 2 Supplier Part Number: 826-9042P; 2 Supplier Unit Price: *; 3 Supplier: *; 3 Supplier Part Number: *; 3 Supplier Unit Price: *; Manufacturer: *; ComponentLink1URL: *; ComponentLink2URL: *; ComponentLink1Description: *; ComponentLink2Description: *; HelpURL: *
R1 R2 R4-R9 R12 R21 = RES_SMD: Resistenza; SMD/TH: SMD; 1 Supplier: *; 1 Supplier Part Number: *; 1 Supplier Unit Price: *; 2 Supplier: *; 2 Supplier Part Number: *; 2 Supplier Unit Price: *; 3 Supplier: *; 3 Supplier Part Number: *; 3 Supplier Unit Price: *; ArSilicii Part Number: *; Manufacturer: *; Manufacturer Part Number: *; ComponentLink1URL: *; ComponentLink2URL: *; ComponentLink1Description: *; ComponentLink2Description: *; HelpURL: *
Rel1 = RELE'_TRS12VDCZ: Relay; ArSilicii Part Number: CR00015100; Manufacturer: Tianbo; SMD/TH: TH; 1 Supplier: DISTAR S.R.L.; 1 Supplier Part Number: TRS12VDCZ; 1 Supplier Unit Price: 0,337; 2 Supplier: STEALTH COMPONENTS, INC.; 2 Supplier Part Number: FRS3M C-S DC12V; 2 Supplier Unit Price: *; 3 Supplier: FITRE S.P.A.; 3 Supplier Part Number: R504D/012Z1F; 3 Supplier Unit Price: *; Manufacturer Part Number: TRS12VDCZ; ComponentLink1URL: http://www.spbnek.ru/mycontent/firm/tianbo/trs.pdf; ComponentLink2URL: *; ComponentLink1Description: Datasheet for TRS12VDCZ; ComponentLink2Description: *; HelpURL: *
TR1 = NPN_MMBT2222ALT1G: as TR2 on sheet PR2017-DC_LoadMotherBoard; Supplier 1: Farnell; Supplier Part Number 1: 1459098; 1 Supplier: ARROW ELECTRONICS ITALIA S.R.L.; 1 Supplier Part Number: SCGMMBT2222ALT1G; 1 Supplier Unit Price: 0,00777; 2 Supplier: Farnell; 2 Supplier Part Number: 1459098; 2 Supplier Unit Price: 0,085; 3 Supplier: *; 3 Supplier Part Number: *; 3 Supplier Unit Price: *; Manufacturer Part Number: MMBT2222ALT1G; ComponentLink1URL: http://www.onsemi.com/pub_link/Collateral/MMBT2222LT1-D.PDF; ComponentLink2URL: *; ComponentLink1Description: Datasheet for MMBT2222ALT1G; ComponentLink2Description: *; HelpURL: D:\Documenti ArSilicii\DataSheet\Transistor\MMBT2222LT1-D.pdf
U2 = NCS20071: as U7 on sheet PR2017-DC_LoadMotherBoard; 1 Supplier: DigiKey; 1 Supplier Part Number: MCP6021-E/SN-ND; 1 Supplier Unit Price: 1,22; 2 Supplier: *; 2 Supplier Part Number: *; 2 Supplier Unit Price: *; 3 Supplier: *; 3 Supplier Part Number: *; 3 Supplier Unit Price: *; ArSilicii Part Number: *; ComponentLink1URL: http://ww1.microchip.com/downloads/en/DeviceDoc/21685d.pdf; ComponentLink2URL: *; ComponentLink1Description: Datasheet for MCP6021; ComponentLink2Description: *; HelpURL: *
U3 = INA240: Current sense amplifier; SMD/TH: SMD; 2 Supplier Unit Price: *; 3 Supplier: *; 3 Supplier Part Number: *; 3 Supplier Unit Price: *; ComponentLink2URL: *; ComponentLink2Description: *

## Sheet Supply.SchDoc
size A4; Organization: ArSilicii s.r.l.; Address1: Via Sardegna, 11; Address2: 53036 Poggibonsi (SI)  - ITALY -; Address3: e-mail : ArSilicii@ArSilicii.com; SheetNumber: 0; SheetTotal: 0
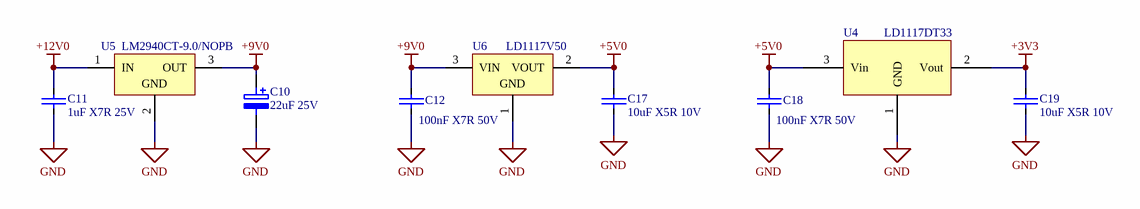
[diagram p2: Supply.SchDoc]

### Parts
C10  22uF 25V  [TANT_D]
C11  1uF X7R 25V  [0805]
C12  100nF X7R 50V  [0805]
C17  10uF X5R 10V  [0805]
C18  100nF X7R 50V  [0805]
C19  10uF X5R 10V  [0805]
U4  LD1117DT33  [TO-252-7805]
U5  LM2940CT-9.0/NOPB  [NDE0003A]
U6  LD1117V50  [TO220]

### Nets
+3V3: C19.1 U4.2(Vout)
+5V0: C17.1 C18.1 U4.3(Vin) U6.2(VOUT)
+9V0: C10.1 C12.1 U5.3(OUT) U6.3(VIN)
+12V0: C11.1 U5.1(IN)
GND: C10.2 C11.2 C12.2 C17.2 C18.2 C19.2 U4.1(GND) U5.2(GND) U6.1(GND)

### Notes on the sheet
- Title :
- Size:
- Date:
- A4
- Version:
- Sheet
- of
- Designer:
- Revisor:

### Library data of the parts
C10 = CAP_TANT_22uF 25V Case D: Capacità polarizzata; ArSilicii Part Number: CPC0352022; Manufacturer: Kemet; Manufacturer Part Number: T491D226K025AT; SMD/TH: SMD; 1 Supplier: DISTAR S.R.L.; 1 Supplier Part Number: KETT491D226K025AT; 1 Supplier Unit Price: 0,060; 2 Supplier: ABACUS ECC S.R.L. - UNIPERSONALE; 2 Supplier Part Number: KETT491D226K025AT; 2 Supplier Unit Price: *; 3 Supplier: ARROW ELECTRONICS ITALIA S.R.L.; 3 Supplier Part Number: KETT491D226K025AT; 3 Supplier Unit Price: *; ComponentLink1URL: *; ComponentLink2URL: *; ComponentLink1Description: *; ComponentLink2Description: *; HelpURL: *
C11 = CAP_1uF X7R 25V_0805: Capacità; ArSilicii Part Number: CPC0212002; Manufacturer: Samsung; Manufacturer Part Number: CL21B105KAFNNNG; SMD/TH: SMD; 1 Supplier: AVNET EMG ITALY S.R.L.; 1 Supplier Part Number: CL21B105KAFNNNG; 1 Supplier Unit Price: *; 2 Supplier: *; 2 Supplier Part Number: *; 2 Supplier Unit Price: *; 3 Supplier: *; 3 Supplier Part Number: *; 3 Supplier Unit Price: *; ComponentLink1URL: *; ComponentLink2URL: *; ComponentLink1Description: *; ComponentLink2Description: *; HelpURL: *
C12 C18 = CAP_100nF X7R 50V_0805: Capacità; ArSilicii Part Number: CPC0213100; Manufacturer: Kemet; Manufacturer Part Number: C0805C104K5RAC7800; SMD/TH: SMD; 1 Supplier: ARROW ELECTRONICS ITALIA S.R.L.; 1 Supplier Part Number: C0805C104K5RAC7800; 1 Supplier Unit Price: 0,00240; 2 Supplier: AVNET EMG ITALY S.R.L.; 2 Supplier Part Number: 08055C104KAT2A AVX; 2 Supplier Unit Price: *; 3 Supplier: *; 3 Supplier Part Number: *; 3 Supplier Unit Price: *; ComponentLink1URL: *; ComponentLink2URL: *; ComponentLink1Description: *; ComponentLink2Description: *; HelpURL: *
C17 C19 = CAP_10uF X5R 10V_0805: Capacità; ArSilicii Part Number: CPC0212010; Manufacturer: Samsung; Manufacturer Part Number: CL21A106KPFNNNE; SMD/TH: SMD; 1 Supplier: ARROW ELECTRONICS ITALIA S.R.L.; 1 Supplier Part Number: CL21A106KPFNNNE; 1 Supplier Unit Price: *; 2 Supplier: *; 2 Supplier Part Number: *; 2 Supplier Unit Price: *; 3 Supplier: *; 3 Supplier Part Number: *; 3 Supplier Unit Price: *; ComponentLink1URL: *; ComponentLink2URL: *; ComponentLink1Description: *; ComponentLink2Description: *; HelpURL: \\Sorp\articoli\CPC0212010\F3102_CerPerChar.pdf
U4 = LD1117DT33: Regolatore Low Dropout; ArSilicii Part Number: IC01000010; Manufacturer: ST; SMD/TH: SMD; 1 Supplier: HT COMPONENTI ELETTRONICI S.R.L.; 1 Supplier Part Number: LD1117DT33TR TO252-3; 1 Supplier Unit Price: 0,105; 2 Supplier: EBV ELEKTRONIK S.R.L.; 2 Supplier Part Number: *; 2 Supplier Unit Price: *; 3 Supplier: *; 3 Supplier Part Number: *; 3 Supplier Unit Price: *; Manufacturer Part Number: LD1117DT33; ComponentLink1URL: http://www.st.com/st-web-ui/static/active/en/resource/technical/document/datasheet/CD00000544.pdf; ComponentLink2URL: *; ComponentLink1Description: Datasheet for LD1117DT33; ComponentLink2Description: *; HelpURL: D:\Documenti ArSilicii\DataSheet\Regolatori\LD1117.pdf
U5 = CMP-0062-02531-3: 1A Low Dropout Regulator, 3-pin TO-220, Pb-Free; Manufacturer: Texas Instruments; CompType: LDO IC; PowerWise: N; PackageTopMarking: NSUZXYTTE#*LM2940CT*-9.0 P+; PackageDescription: TO-220, Molded, 3 Lead, Straight; PackageReference: NDE0003A; PinCount: 3; ComponentLink1URL: http://www.ti.com/general/docs/lit/getliterature.tsp?genericPartNumber=LM2940C&fileType=pdf; ComponentLink1Description: Datasheet URL; RoHS: Y
U6 = CMP-0244-00472-1: Fixed Low Drop Positive Voltage Regulator, 5V, 3-Pin TO-220; ComponentLink1URL: http://www.st.com; ComponentLink1Description: Manufacturer URL; DatasheetVersion: 1/11/2011; PackageDescription: TO, Thru-Hole, Vertical, Heatsink Mounted; 3 In-Line Leads; Pitch 2.54 mm; ComponentLink2Description: Datasheet; ComponentLink3URL: http://www.st.com/internet/com/TECHNICAL_RESOURCES/TECHNICAL_LITERATURE/PACKAGE_INFORMATION/CD00004649.pdf; PackageVersion: ver3.0; PackageReference: TO220; ComponentLink2URL: http://www.st.com/internet/com/TECHNICAL_RESOURCES/TECHNICAL_LITERATURE/DATASHEET/CD00000544.pdf; ComponentLink3Description: Package Specification

## Nets that join several sheets
+3V3: PR2017-DC_LoadMotherBoard (6 pins), Supply (C19.1 U4.2)
+5V0: PR2017-DC_LoadMotherBoard (6 pins), U_Pwr1 (L2_U_Pwr1.1), U_Pwr2 (L2_U_Pwr2.1), U_Pwr3 (L2_U_Pwr3.1), U_Pwr4 (L2_U_Pwr4.1), Supply (C17.1 C18.1 U4.3 U6.2)
+9V0: PR2017-DC_LoadMotherBoard (L4.1 L5.1), U_Pwr1 (L1_U_Pwr1.1), U_Pwr2 (L1_U_Pwr2.1), U_Pwr3 (L1_U_Pwr3.1), U_Pwr4 (L1_U_Pwr4.1), Supply (C10.1 C12.1 U5.3 U6.3)
+12V0: PR2017-DC_LoadMotherBoard (7 pins), U_Pwr1 (D3_U_Pwr1.K Rel1_U_Pwr1.2), U_Pwr2 (D3_U_Pwr2.K Rel1_U_Pwr2.2), U_Pwr3 (D3_U_Pwr3.K Rel1_U_Pwr3.2), U_Pwr4 (D3_U_Pwr4.K Rel1_U_Pwr4.2), Supply (C11.1 U5.1)
GND: PR2017-DC_LoadMotherBoard (46 pins), U_Pwr1 (19 pins), U_Pwr2 (19 pins), U_Pwr3 (19 pins), U_Pwr4 (19 pins), Supply (9 pins)
NetR21_U_Pwr1_1: PR2017-DC_LoadMotherBoard (U1.6), U_Pwr1 (R21_U_Pwr1.1), U_Pwr2 (R21_U_Pwr2.1), U_Pwr3 (R21_U_Pwr3.1), U_Pwr4 (R21_U_Pwr4.1)
Out_Current1: PR2017-DC_LoadMotherBoard (J3.19 RN1.1), U_Pwr1 (U2_U_Pwr1.3 U3_U_Pwr1.8)
Out_Current2: PR2017-DC_LoadMotherBoard (J3.17 RN1.2), U_Pwr2 (U2_U_Pwr2.3 U3_U_Pwr2.8)
Out_Current3: PR2017-DC_LoadMotherBoard (J3.15 RN1.3), U_Pwr3 (U2_U_Pwr3.3 U3_U_Pwr3.8)
Out_Current4: PR2017-DC_LoadMotherBoard (J3.13 RN1.4), U_Pwr4 (U2_U_Pwr4.3 U3_U_Pwr4.8)
Power_Input: PR2017-DC_LoadMotherBoard (8 pins), U_Pwr1 (D1_U_Pwr1.2 Q1_U_Pwr1.2 R12_U_Pwr1.1), U_Pwr2 (D1_U_Pwr2.2 Q1_U_Pwr2.2 R12_U_Pwr2.1), U_Pwr3 (D1_U_Pwr3.2 Q1_U_Pwr3.2 R12_U_Pwr3.1), U_Pwr4 (D1_U_Pwr4.2 Q1_U_Pwr4.2 R12_U_Pwr4.1)
Power_N: PR2017-DC_LoadMotherBoard (11 pins), U_Pwr1 (R6_U_Pwr1.2 R7_U_Pwr1.2 R8_U_Pwr1.1 U3_U_Pwr1.3), U_Pwr2 (R6_U_Pwr2.2 R7_U_Pwr2.2 R8_U_Pwr2.1 U3_U_Pwr2.3), U_Pwr3 (R6_U_Pwr3.2 R7_U_Pwr3.2 R8_U_Pwr3.1 U3_U_Pwr3.3), U_Pwr4 (R6_U_Pwr4.2 R7_U_Pwr4.2 R8_U_Pwr4.1 U3_U_Pwr4.3)
Range: PR2017-DC_LoadMotherBoard (J10.20 R10.2), U_Pwr1 (R9_U_Pwr1.2), U_Pwr2 (R9_U_Pwr2.2), U_Pwr3 (R9_U_Pwr3.2), U_Pwr4 (R9_U_Pwr4.2)
Temperature1: PR2017-DC_LoadMotherBoard (J3.5), U_Pwr1 (C14_U_Pwr1.1 J2_U_Pwr1.2)
Temperature2: PR2017-DC_LoadMotherBoard (J3.7), U_Pwr2 (C14_U_Pwr2.1 J2_U_Pwr2.2)
Temperature3: PR2017-DC_LoadMotherBoard (J3.9), U_Pwr3 (C14_U_Pwr3.1 J2_U_Pwr3.2)
Temperature4: PR2017-DC_LoadMotherBoard (J3.11), U_Pwr4 (C14_U_Pwr4.1 J2_U_Pwr4.2)